# EAGLE schematic TVI-Kbd-converter (EAGLE 9.2.2)
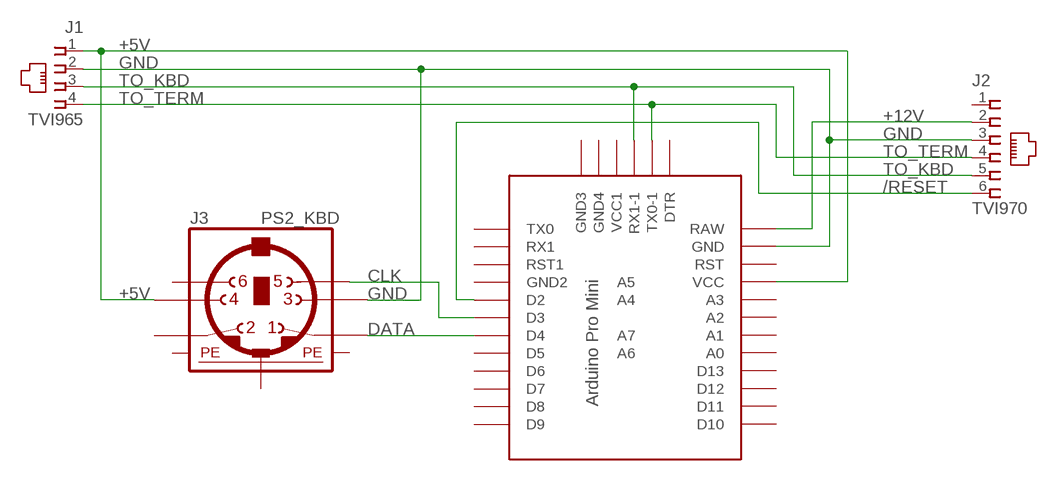
[diagram p0: schematic, sheet 1]

## Parts
J1  TVI965  215875-3  [215875-3]
J2  TVI970  555165-1  [555165-1]
J3  PS2_KBD  MINI_DIN_6  [M_DIN6]
U$1  PRO-MINI-2  [PRO-MINI-2]

## Nets
+5V: J1.1 J3.5 U$1.VCC
+12V: J2.2 U$1.RAW
/RESET: J2.6 U$1.D2
CLK: J3.6 U$1.D3
DATA: J3.1 U$1.D4
GND: J1.2 J2.3 J3.3 U$1.GND
TO_KBD: J1.3 J2.5 U$1.RX1-1
TO_TERM: J1.4 J2.4 U$1.TX0-1
Unconnected: J2.1 J3.2 J3.8 U$1.A0 U$1.A1 U$1.A2 U$1.A3 U$1.A4 U$1.A5 U$1.A6 U$1.A7 U$1.D5 U$1.D6 U$1.D7 U$1.D8 U$1.D9 U$1.D10 U$1.D11 U$1.D12 U$1.D13 U$1.DTR U$1.GND1(GND2) U$1.GND2(GND3) U$1.GND3(GND4) U$1.RST U$1.RST1 U$1.RX1 U$1.TX0 U$1.VCC1

## Power pins joined to a net without a drawn wire
PE1: J3.SH1(PE1)
PE2: J3.SH2(PE2)
PE3: J3.SH3(PE3)

## Library data of the parts
J1 = con-amp:215875-3: AMP connector
J2 = con-amp:555165-1: AMP connector
J3 = mini_din:MINI_DIN_6
U$1 = Arduino-clone:PRO-MINI-2: Arduino Pro Mini Layout 2 Sparkfun.com